# Altium schematic sheet TL200 触摸板.SchDoc
size A4; PageSetup: Record=PageOptions|CenterHorizontal=True|CenterVertical=True|PrintScale=0.50|XCorrection=1.00|YCorrection=1.00|PrintKind=0|BorderSize=5000000|LeftOffset=0|BottomOffset=0|Orientation=2|PaperLength=1000|PaperWidth=1000|Scale=100|PaperSource=7|PrintQuality=-4|MediaType=1|DitherType=10|PaperKind=A4|PrintScaleMode=1
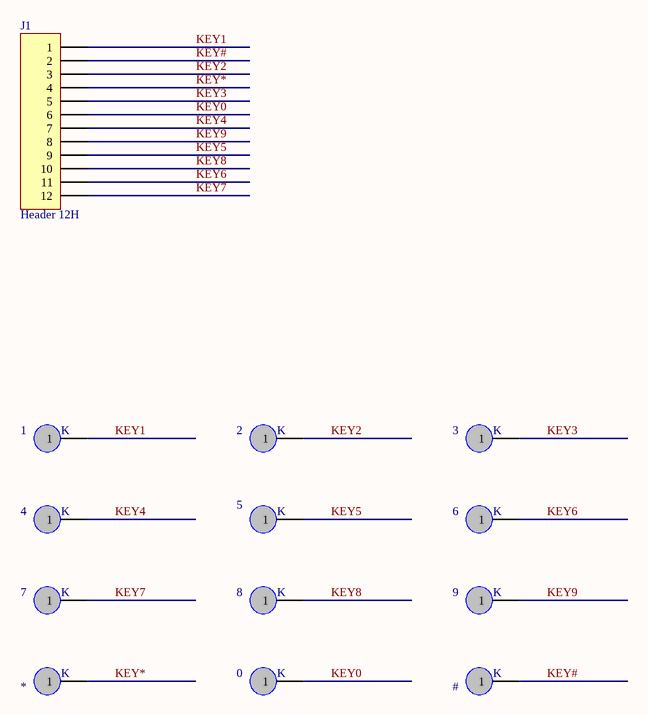
[diagram p0: TL200 触摸板.SchDoc]

## Parts
0  K  [보턍1]
1  K  [보턍1]
2  K  [보턍1]
3  K  [보턍1]
4  K  [보턍1]
5  K  [보턍1]
6  K  [보턍1]
7  K  [보턍1]
8  K  [보턍1]
9  K  [보턍1]
#  K  [보턍1]
*  K  [보턍1]
J1  Header 12H  [SMT-6P*2*1.27MM]

## Nets
KEY0: 0.1 J1.6
KEY1: 1.1 J1.1
KEY2: 2.1 J1.3
KEY3: 3.1 J1.5
KEY4: 4.1 J1.7
KEY5: 5.1 J1.9
KEY6: 6.1 J1.11
KEY7: 7.1 J1.12
KEY8: 8.1 J1.10
KEY9: 9.1 J1.8
KEY#: #.1 J1.2
KEY*: *.1 J1.4

## Library data of the parts
0-9 # * = KEY-1
J1 = Header 12H: Header, 12-Pin, Right Angle; LatestRevisionDate: 17-Jul-2002; LatestRevisionNote: Re-released for DXP Platform.; Publisher: Altium Limited